# Altium schematic sheet DAC.SchDoc: DAC
size A3; Author: M.Beldyga; CompanyName: WUT ISE; DrawnBy: M.Beldyga; Organization: WUT ISE; Address1: PW ISE; Address2: Nowowiejska 15/19 00-665 Warsaw; Address3: micbeldyga@gmail.com; SheetNumber: 5; SheetTotal: 12; ModifiedBy: -; CheckedDate: -; Title2: 12b 16ch; DivGrp: WUT ISE; Designer: M.Beldyga; ModifiedDate: -; ProjectName: Sensor Box
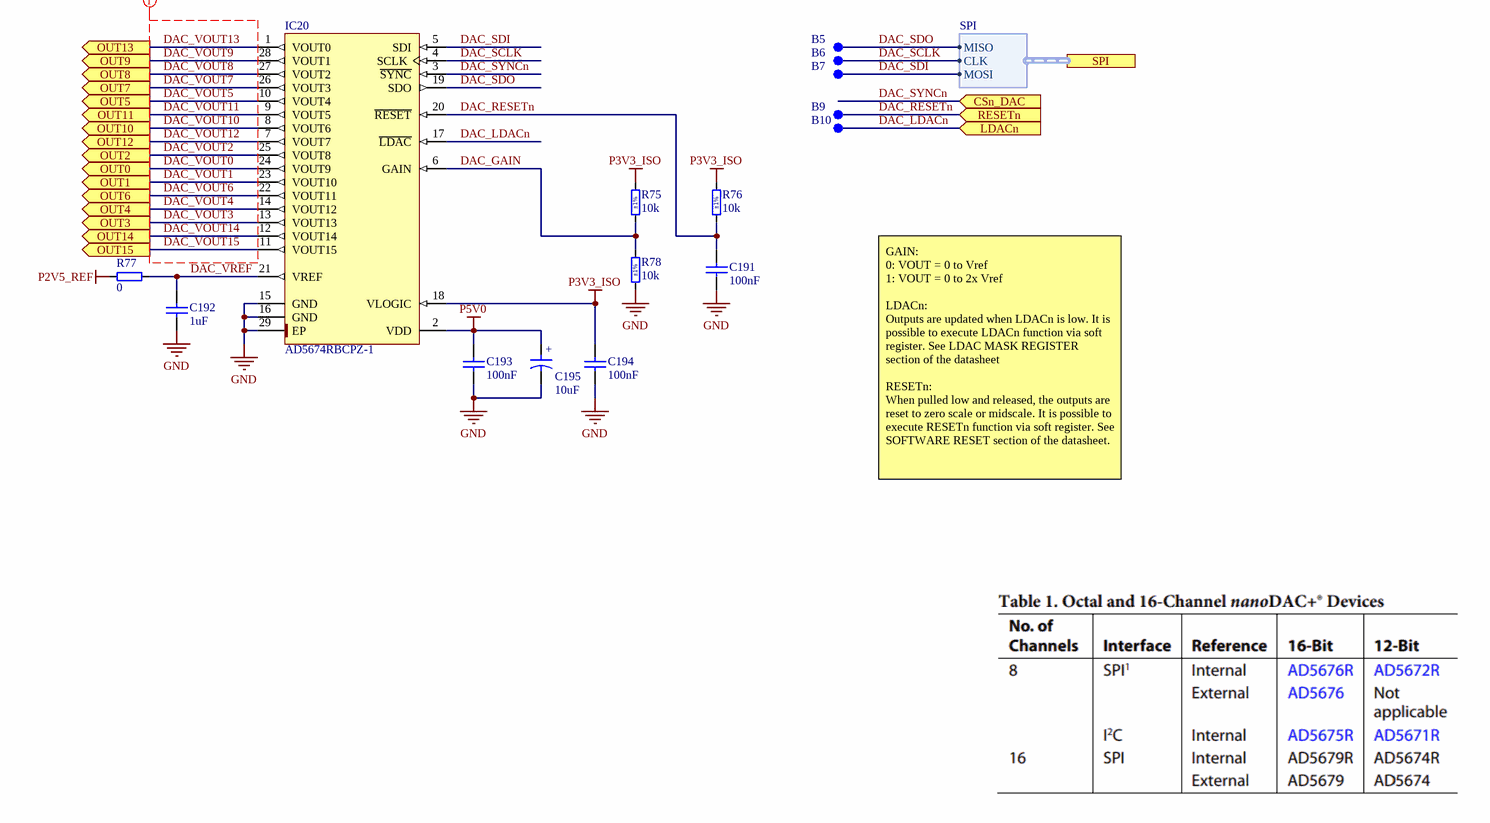
[diagram p0: DAC.SchDoc]

## Parts
B5  SMD Pad  [C100]  (value not drawn)  (no BOM)
B6  SMD Pad  [C100]  (value not drawn)  (no BOM)
B7  SMD Pad  [C100]  (value not drawn)  (no BOM)
B9  SMD Pad  [C100]  (value not drawn)  (no BOM)
B10  SMD Pad  [C100]  (value not drawn)  (no BOM)
C191  100nF  [CAPC1005X55N]
C192  1uF  [CAPC1005X55N]
C193  100nF  [CAPC1005X55N]
C194  100nF  [CAPC1005X55N]
C195  10uF  [CAPMP3216X180N]
IC20  AD5674RBCPZ-1  [QFN40P400X400X100-29N-S270]
R75  10k  Tolerance: ±1%  [RESC1005X40N]
R76  10k  Tolerance: ±1%  [RESC1005X40N]
R77  0  [RESC1005X40N]
R78  10k  Tolerance: ±1%  [RESC1005X40N]

## Ports
CSn_DAC (in), LDACn (in), OUT0 (out), OUT1 (out), OUT2 (out), OUT3 (out), OUT4 (out), OUT5 (out), OUT6 (out), OUT7 (out), OUT8 (out), OUT9 (out), OUT10 (out), OUT11 (out), OUT12 (out), OUT13 (out), OUT14 (out), OUT15 (out), RESETn (in), SPI (harness SPI)

## Harnesses
SPI: CLK, MOSI, MISO

## Nets
GND: C191.1 C192.1 C193.1 C194.1 C195.2 IC20.15(GND) IC20.16(GND) IC20.29(EP) R78.1
P2V5_REF: R77.1
P3V3_ISO: C194.2 IC20.18(VLOGIC) R75.2 R76.2
P5V0: C193.2 C195.1 IC20.2(VDD)
DAC_GAIN: IC20.6(GAIN) R75.1 R78.2
DAC_LDACn: B10.1 IC20.17(~{LDAC}) ; port LDACn
DAC_RESETn: B9.1 C191.2 IC20.20(~{RESET}) R76.1 ; port RESETn
DAC_SCLK: B6.1 IC20.4(SCLK) ; port SPI.CLK
DAC_SDI: B7.1 IC20.5(SDI) ; port SPI.MOSI
DAC_SDO: B5.1 IC20.19(SDO) ; port SPI.MISO
DAC_SYNCn: IC20.3(~{SYNC}) ; port CSn_DAC
DAC_VOUT0: IC20.24(VOUT9) ; port OUT0
DAC_VOUT1: IC20.23(VOUT10) ; port OUT1
DAC_VOUT2: IC20.25(VOUT8) ; port OUT2
DAC_VOUT3: IC20.13(VOUT13) ; port OUT3
DAC_VOUT4: IC20.14(VOUT12) ; port OUT4
DAC_VOUT5: IC20.10(VOUT4) ; port OUT5
DAC_VOUT6: IC20.22(VOUT11) ; port OUT6
DAC_VOUT7: IC20.26(VOUT3) ; port OUT7
DAC_VOUT8: IC20.27(VOUT2) ; port OUT8
DAC_VOUT9: IC20.28(VOUT1) ; port OUT9
DAC_VOUT10: IC20.8(VOUT6) ; port OUT10
DAC_VOUT11: IC20.9(VOUT5) ; port OUT11
DAC_VOUT12: IC20.7(VOUT7) ; port OUT12
DAC_VOUT13: IC20.1(VOUT0) ; port OUT13
DAC_VOUT14: IC20.12(VOUT14) ; port OUT14
DAC_VOUT15: IC20.11(VOUT15) ; port OUT15
DAC_VREF: C192.2 IC20.21(VREF) R77.2

## Layout directives
net class DAC: DAC_VOUT0, DAC_VOUT1, DAC_VOUT2, DAC_VOUT3, DAC_VOUT4, DAC_VOUT5, DAC_VOUT6, DAC_VOUT7, DAC_VOUT8, DAC_VOUT9, DAC_VOUT10, DAC_VOUT11, DAC_VOUT12, DAC_VOUT13, DAC_VOUT14, DAC_VOUT15

## Notes on the sheet
- GAIN:
  0: VOUT = 0 to Vref
  1: VOUT = 0 to 2x Vref
  LDACn:
  Outputs are updated when LDACn is low. It is possible to execute LDACn function via soft register. See LDAC MASK REGISTER section of the datasheet
  RESETn:
  When pulled low and released, the outputs are reset to zero scale or midscale. It is possible to execute RESETn function via soft register. See SOFTWARE RESET section of the datasheet.
- Project/Equipment
- Document
- Designer
- Drawn by
- Check.by
- Contact
- File
- Last Mod.
- Print Date
- Sheet
- Size
- A3
- of
- Rev
- (in symbol CTE3216-18_10UF_16V_20%_AVX_TCJ) +

## Library data of the parts
B5-B7 B9 B10 = SMD_PAD_D1MM: Pad; Part Description: 1mm Diameter SMD Pad; Mounted: No; Part Number: SMD_PAD_D1MM; Component Type: Standard (No BOM); Pin Count: 1; Family: SMD Pad; Socket: No; SMD: Yes; Sense: No; Status: None; ComponentHeight: 0mm; HelpURL: Undefined; Author: CERN DEM JLC; CreateDate: 10/10/2017; LatestRevisionDate: 10/10/2017; PackageDescription: 1mm Diameter SMD Pad
C191 C193 C194 = CC0402_100NF_50V_10%_X7R: Non-polarised capacitor; Part Description: SMD Multilayer Chip Ceramic Capacitor; Manufacturer: GENERIC; Manufacturer1 Part Number: GRM155R71H104KE14D; Voltage: 50V; TC: X7R; Tolerance: ±10%; Part Number: CC0402_100NF_50V_10%_X7R; Component Kind: Standard; Component Type: Standard; Pin Count: 2; Value: 100nF; Status: None; Manufacturer Part Number: CC0402_100NF_50V_10%_X7R; Case: 0402; Mounted: Yes; Socket: No; SMD: Yes; Sense: No; Manufacturer1 Example: MURATA; Manufacturer1 ComponentHeight: 0.55mm; HelpURL: \\cern.ch\dfs\Applications\Altium\Datasheets\CC0402_MURATA_GRM155R71H104KE14D.pdf; Author: CERN DEM MR; CreateDate: 6/30/2017; LatestRevisionDate: 6/30/2017
C192 = CC0402_1UF_16V_10%_X5R: Non-polarised capacitor; Part Description: SMD Multilayer Chip Ceramic Capacitor; Manufacturer: GENERIC; Manufacturer1 Part Number: C1005X5R1C105KT; Voltage: 16V; TC: X5R; Tolerance: ±10%; Part Number: CC0402_1UF_16V_10%_X5R; Component Kind: Standard; Component Type: Standard; Pin Count: 2; Value: 1uF; Status: Preferred; Manufacturer Part Number: CC0402_1UF_16V_10%_X5R; Case: 0402; Mounted: Yes; Socket: No; SMD: Yes; Sense: No; Manufacturer1 Example: TDK; Manufacturer1 ComponentHeight: 0.55mm; HelpURL: \\cern.ch\dfs\Applications\Altium\Datasheets\CC0402_X5R_TDK_C.pdf; Author: CERN DEM JLC; CreateDate: 10/25/2012; LatestRevisionDate: 10/25/2012
C195 = CTE3216-18_10UF_16V_20%_AVX_TCJ: Polarised capacitor; Part Description: ESR 0R200 Tantalum Solid Electrolytic Chip Capacitor with Conductive Polymer Electrode; Manufacturer: AVX; Manufacturer Part Number: TCJA106M016R0200; Voltage: 16V; Tolerance: ±20%; Part Number: CTE3216-18_10UF_16V_20%_AVX_TCJ; Component Kind: Standard; Component Type: Standard; Pin Count: 2; Value: 10uF; Status: Preferred; Case: A; Mounted: Yes; Socket: No; SMD: Yes; Sense: No; ComponentHeight: 1.8mm; HelpURL: \\cern.ch\dfs\Applications\Altium\Datasheets\CTE_AVX_TCJ.pdf; Author: CERN DEM JLC; CreateDate: 29.03.2012; LatestRevisionDate: 29.03.2012
IC20 = AD5674RBCPZ-1: 12-Bit nanoDAC+ with 2 ppm/°C Voltage Reference Temperature Coefficient, SPI Interface; Manufacturer: ANALOG DEVICES; PressFit: No; Bonding: No; Part Number: AD5674RBCPZ-1; Component Kind: Standard; Component Type: Standard; Device: AD5674RBCPZ-1; PackageDescription: QFN, 0.40mm Pitch, Square; 28 Pin, 4.00mm L X 4.00mm W X 1.00mm H body (w/Thermal Tab 2.70 X 2.70mm), IPC Medium Density; Part Description: 12-Bit nanoDAC+ with 2 ppm/°C Voltage Reference Temperature Coefficient, SPI Interface; Manufacturer Part Number: AD5674RBCPZ-1; Pin Count: 28; Case: QFN28; Mounted: Yes; Socket: No; SMD: Yes; Sense: No; ComponentHeight: 1.0mm; Author: CERN DEM HF; HelpURL: \\cern.ch\dfs\Applications\Altium\Datasheets\AD5674RBCPZ-1.pdf; CreateDate: 4/19/2022; LatestRevisionDate: 4/19/2022
R75 R76 R78 = R0402_10K_1%_0.0625W_100PPM: Resistor - 1%; Part Description: General Purpose Thick Film Chip Resistor; Manufacturer: GENERIC; Manufacturer1 Part Number: 232270671003L; TC: ±100ppm/°C; PressFit: No; Part Number: R0402_10K_1%_0.0625W_100PPM; Component Kind: Standard; Component Type: Standard; Pin Count: 2; Value: 10k; Status: Not Recommended; Power: 0.0625W; Manufacturer Part Number: R0402_10K_1%_0.0625W_100PPM; Case: 0402; Mounted: Yes; Sense: No; Socket: No; SMD: Yes; Manufacturer1 Example: YAGEO PHYCOMP; Manufacturer1 ComponentHeight: 0.4mm; HelpURL: \\cern.ch\dfs\Applications\Altium\Datasheets\R0402_Phycomp_RC0402.pdf; Author: CERN DEM JLC; CreateDate: 12/3/2007; LatestRevisionDate: 10/17/2012
R77 = R0402_0R_JUMPER: Resistor; Part Description: 1A (0.05R Max DC Resistance) Zero Ohm Jumper; Manufacturer: GENERIC; Manufacturer1 Part Number: 232270591001L; PressFit: No; Part Number: R0402_0R_JUMPER; Component Kind: Standard; Component Type: Standard; Pin Count: 2; Value: 0; Status: Not Recommended; Manufacturer Part Number: R0402_0R_JUMPER; Case: 0402; Mounted: Yes; Sense: No; Socket: No; SMD: Yes; Manufacturer1 Example: YAGEO PHYCOMP; Manufacturer1 ComponentHeight: 0.4mm; HelpURL: \\cern.ch\dfs\Applications\Altium\Datasheets\R0402_Phycomp_RC0402.pdf; Author: CERN DEM JLC; CreateDate: 12/3/2007; LatestRevisionDate: 10/17/2012